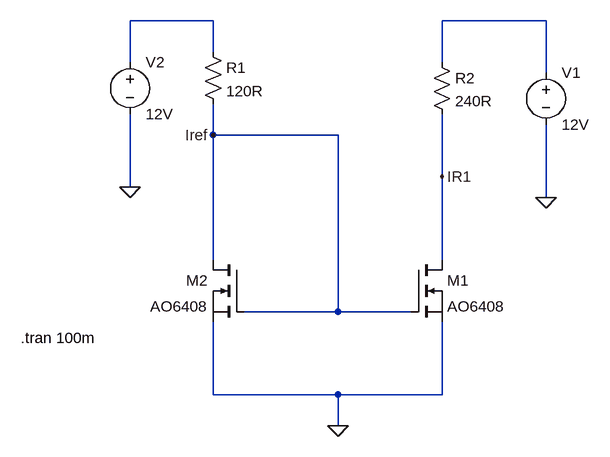
[diagram p0: schematic Current mirror ckt.asc]
Current mirror ckt.asc, the LTspice schematic file:
Version 4.1
SHEET 1 880 680
WIRE -64 -256 -192 -256
WIRE 448 -256 288 -256
WIRE -64 -208 -64 -256
WIRE -192 -192 -192 -256
WIRE 288 -192 288 -256
WIRE 448 -176 448 -256
WIRE -64 -80 -64 -128
WIRE 128 -80 -64 -80
WIRE 288 -16 288 -112
WIRE -192 0 -192 -112
WIRE 448 16 448 -96
WIRE -64 112 -64 -80
WIRE 288 112 288 -16
WIRE 128 192 128 -80
WIRE 128 192 -16 192
WIRE 240 192 128 192
WIRE -64 320 -64 208
WIRE 128 320 -64 320
WIRE 288 320 288 208
WIRE 288 320 128 320
WIRE 128 368 128 320
FLAG 128 368 0
FLAG -192 0 0
FLAG 448 16 0
FLAG -64 -80 Iref
FLAG 288 -16 IR1
SYMBOL nmos 240 112 R0
SYMATTR InstName M1
SYMATTR Value AO6408
SYMBOL nmos -16 112 M0
SYMATTR InstName M2
SYMATTR Value AO6408
SYMBOL voltage 448 -192 R0
SYMATTR InstName V1
SYMATTR Value 12V
SYMBOL voltage -192 -208 R0
SYMATTR InstName V2
SYMATTR Value 12V
SYMBOL res -80 -224 R0
SYMATTR InstName R1
SYMATTR Value 120R
SYMBOL res 272 -208 R0
SYMATTR InstName R2
SYMATTR Value 240R
TEXT -360 232 Left 2 !.tran 100m

The netlist it stands for:
* Current mirror ckt.asc
M1 IR1 Iref 0 0 AO6408
M2 Iref Iref 0 0 AO6408
V1 N002 0 12V
V2 N001 0 12V
R1 N001 Iref 120R
R2 N002 IR1 240R
.model NMOS NMOS
.model PMOS PMOS
.lib standard.mos
.tran 100m
.backanno
.end